# EAGLE board shelves_v05 (EAGLE 9.6.2)
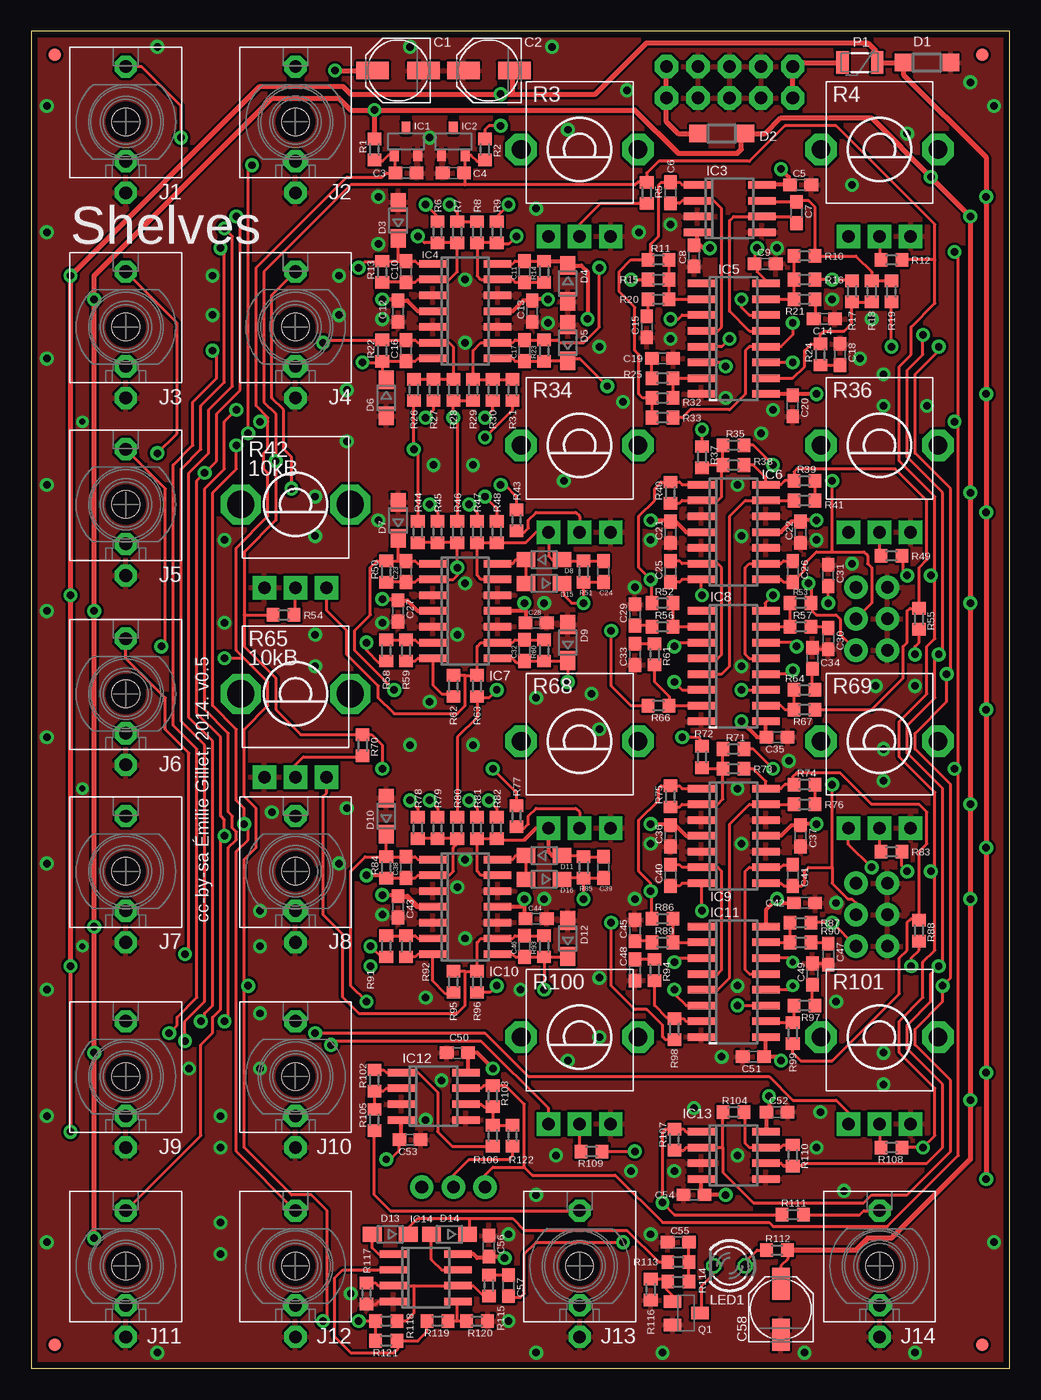
[diagram p5: board, top side]
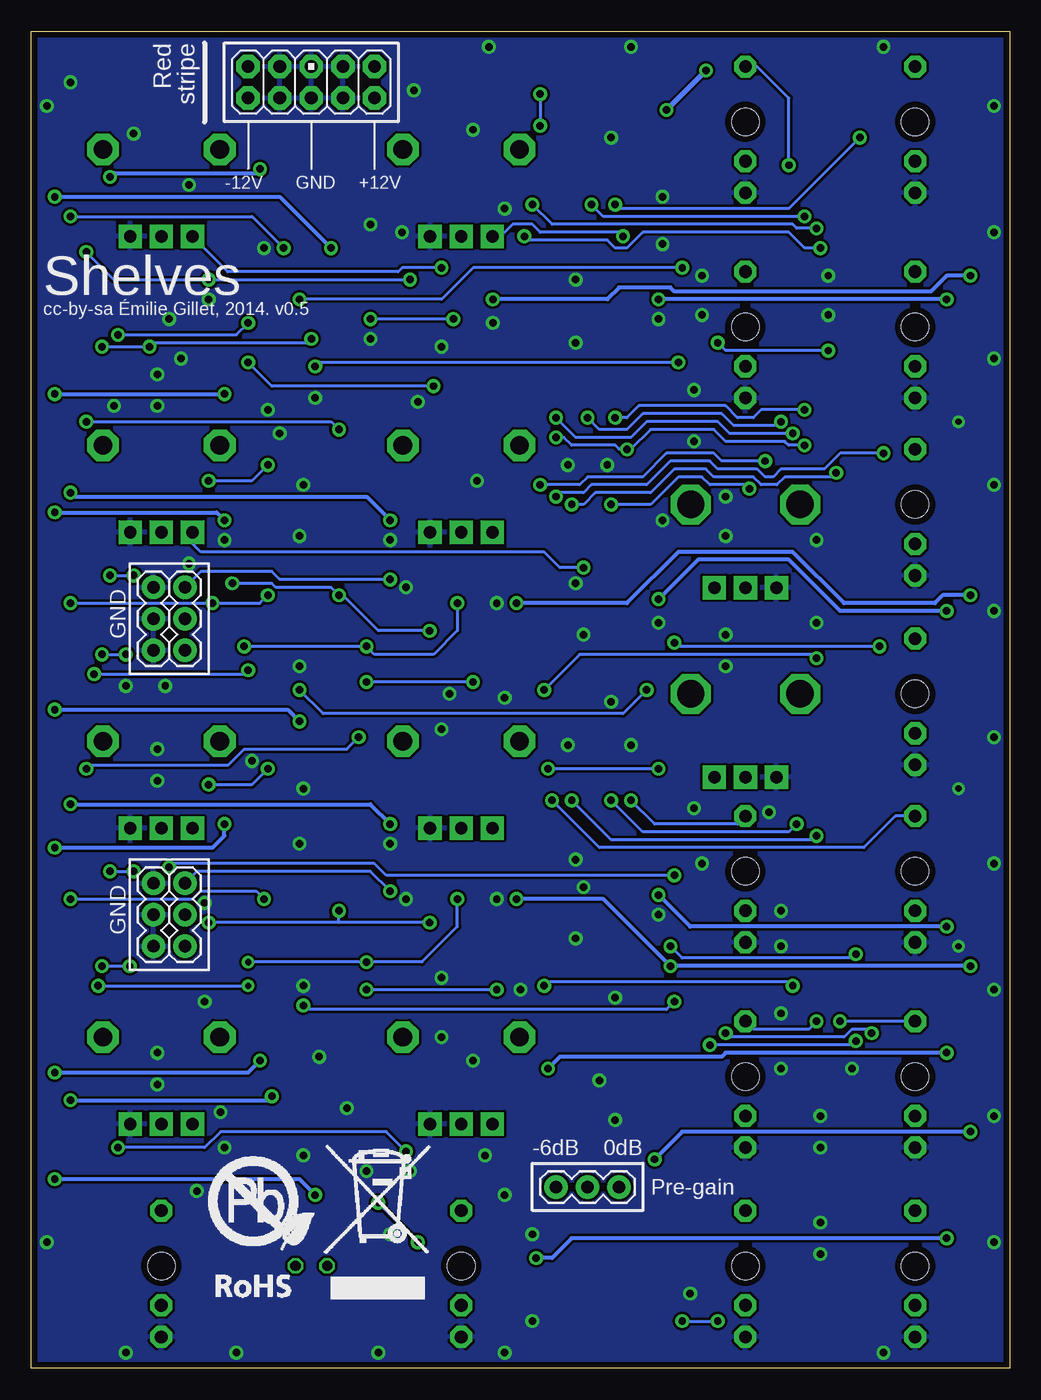
[diagram p6: board, bottom side, seen from below]

Size 78.74 x 107.63 mm. Coordinates in mm from the lower left corner, seen from the top.
Outline: 0,0 78.74,0 78.74,107.63 0,107.63 0,0
Copper layers (1*16): Top 0.035mm / dielectric 1.5mm / Bottom 0.035mm
Design rules "PCBCart-Standard": minimum track width 8mil, minimum drill 0.4mm, track to track 8mil, track to pad 8mil, pad to pad 8mil, via to via 8mil, smd to smd 8mil, copper to edge 20mil, drill to drill 8mil, minimum pad ring 8mil, minimum via ring 10mil, stop-mask expansion 3mil, vias tented up to drill 25mil, thermal gap 8mil

## Footprints (pad centres in the part's own frame; a part is rotated, then mirrored left to right if it is on the bottom)
PANASONIC_C = smd 2.6 x 1.4: + 2.05,0; - -2.05,0
C0603 = smd 1.1 x 1: 1 -0.85,0; 2 0.85,0
SOD123 = smd 1.4 x 1.4: A 1.9,0; C -1.9,0
SOD323-W = smd 1.5 x 1.2: A 1.45,0; C -1.45,0
DBZ_R-PDSO-G3 = smd 0.7 x 1: 1 -0.95,-1.1; 2 0.95,-1.1; 3 0,1.1
SO08 = smd 0.6 x 2.2: 1 -1.905,-2.6; 2 -0.635,-2.6; 3 0.635,-2.6; 4 1.905,-2.6; 5 1.905,2.6; 6 0.635,2.6; 7 -0.635,2.6; 8 -1.905,2.6
SO14 = smd 0.6 x 2.2: 1 -3.81,-2.6; 2 -2.54,-2.6; 3 -1.27,-2.6; 4 0,-2.6; 5 1.27,-2.6; 6 2.54,-2.6; 7 3.81,-2.6; 8 3.81,2.6; 9 2.54,2.6; 10 1.27,2.6; 11 0,2.6; 12 -1.27,2.6; 13 -2.54,2.6; 14 -3.81,2.6
SOIC16N = smd 0.6 x 2.2: 1 -4.445,-2.6; 2 -3.175,-2.6; 3 -1.905,-2.6; 4 -0.635,-2.6; 5 0.635,-2.6; 6 1.905,-2.6; 7 3.175,-2.6; 8 4.445,-2.6; 9 4.445,2.6; 10 3.175,2.6; 11 1.905,2.6; 12 0.635,2.6; 13 -0.635,2.6; 14 -1.905,2.6; 15 -3.175,2.6; 16 -4.445,2.6
WQP_PJ_301M6 = drill 1.016 pad 1.778 octagon: P1 0,-5.715; P2 0,-3.175; P3 0,4.445 | hole 2.2: 0,0
FIDUCIAL-1X2 = smd 1 x 1: 1 0,0
1X03 = drill 1.016 pad 1.88: 1 0,0; 2 2.54,0; 3 5.08,0
AVR_ICSP = drill 1.016 pad 1.88 octagon: 1 -1.27,5.08; 2 1.27,5.08; 3 -1.27,2.54; 4 1.27,2.54; 5 -1.27,0; 6 1.27,0; 7 -1.27,-2.54; 8 1.27,-2.54; 9 -1.27,-5.08; 10 1.27,-5.08
LED3MM = drill 0.813 octagon: A -1.27,0; K 1.27,0
PTC-1206 = smd 1 x 1.8: 1 -1.4,0; 2 1.4,0
SOT23-BEC = smd 1 x 1.4: B -0.95,-1.1; C 0,1.1; E 0.95,-1.1
R0603 = smd 1 x 1.1: 1 -0.85,0; 2 0.85,0
ALPS_POT_VERTICAL_PS = drill 1 pad 1.88 square: P$1 -2.5,7; P$2 0,7; P$3 2.5,7 | drill 1.5 pad 2.54 octagon: P$4 -4.7,0; P$5 4.7,0
ALPS_POT_VERTICAL = drill 1 pad 1.88 square: P$1 -2.5,6.7; P$2 0,6.7; P$3 2.5,6.7 | drill 2.2 pad 3.175 octagon: P$4 -4.4,0; P$5 4.4,0

## Placement (x,y rotation side)
C1  22u  [PANASONIC_C]  29.53,104.46 180 top
C2  22u  [PANASONIC_C]  36.83,104.46 180 top
C3  100n  [C0603]  30.16,96.2 0 top
C4  100n  [C0603]  33.97,96.2 180 top
C5  100n  [C0603]  61.91,95.25 0 top
C6  68p  [C0603]  51.44,94.61 90 top
C7  68p  [C0603]  61.59,93.03 90 top
C8  100n  [C0603]  53.34,89.53 90 top
C9  100n  [C0603]  59.05,88.9 0 top
C10  560p  [C0603]  30.16,88.27 270 top
C11  560p  [C0603]  39.69,88.27 270 top
C12  100n  [C0603]  29.53,85.09 270 top
C13  100n  [C0603]  40.32,85.09 90 top
C14  560p  [C0603]  63.82,84.45 0 top
C15  560p  [C0603]  49.53,83.82 270 top
C16  560p  [C0603]  30.16,81.92 90 top
C17  560p  [C0603]  39.69,81.92 90 top
C18  560p  [C0603]  65.09,81.6 90 top
C19  560p  [C0603]  50.8,81.28 0 top
C20  100n  [C0603]  61.28,77.47 90 top
C21  100n  [C0603]  51.44,67.31 270 top
C22  100n  [C0603]  61.91,67.31 90 top
C23  560p  [C0603]  30.16,64.14 270 top
C24  560p  [C0603]  46.04,64.14 90 top
C25  68p  [C0603]  51.44,64.14 270 top
C26  68p  [C0603]  61.28,64.14 270 top
C27  100n  [C0603]  29.53,60.96 270 top
C28  100n  [C0603]  40.64,60.01 180 top
C29  560p  [C0603]  48.58,60.64 90 top
C30  560p  [C0603]  64.14,58.74 270 top
C31  100n  [C0603]  64.14,63.82 90 top
C32  560p  [C0603]  39.69,57.78 90 top
C33  560p  [C0603]  48.58,57.47 270 top
C34  560p  [C0603]  62.87,57.15 90 top
C35  100n  [C0603]  60.01,50.8 180 top
C36  100n  [C0603]  51.44,42.86 270 top
C37  100n  [C0603]  61.91,42.86 90 top
C38  560p  [C0603]  30.16,40.32 270 top
C39  560p  [C0603]  46.04,40.32 90 top
C40  68p  [C0603]  51.44,39.69 270 top
C41  68p  [C0603]  61.28,39.69 270 top
C42  100n  [C0603]  62.23,37.47 0 top
C43  100n  [C0603]  29.53,37.15 270 top
C44  100n  [C0603]  40.64,36.2 180 top
C45  560p  [C0603]  48.58,35.24 90 top
C46  560p  [C0603]  39.69,33.97 90 top
C47  560p  [C0603]  64.14,33.34 270 top
C48  560p  [C0603]  48.58,32.07 270 top
C49  560p  [C0603]  62.87,31.75 90 top
C50  100n  [C0603]  34.29,25.4 180 top
C51  100n  [C0603]  58.1,25.08 0 top
C52  100n  [C0603]  60.01,20.64 0 top
C53  100n  [C0603]  30.48,18.41 180 top
C54  100n  [C0603]  53.34,13.97 0 top
C55  100n  [C0603]  52.07,10.16 180 top
C56  100n  [C0603]  36.83,9.84 90 top
C57  100n  [C0603]  38.42,6.67 270 top
C58  22u  [PANASONIC_C]  60.33,4.76 90 top
D1  1N5819HW  [SOD123]  72.07,105.09 180 top
D2  1N5819HW  [SOD123]  55.56,99.38 180 top
D3  1N4148  [SOD323-W]  29.53,92.39 90 top
D4  1N4148  [SOD323-W]  43.18,87.31 270 top
D5  1N4148  [SOD323-W]  43.18,82.55 90 top
D6  1N4148  [SOD323-W]  28.57,78.11 270 top
D7  1N4148  [SOD323-W]  29.53,68.26 90 top
D8  1N4148  [SOD323-W]  41.27,65.09 0 top
D9  1N4148  [SOD323-W]  43.18,58.42 90 top
D10  1N4148  [SOD323-W]  28.57,44.45 90 top
D11  1N4148  [SOD323-W]  41.27,41.27 0 top
D12  1N4148  [SOD323-W]  43.18,34.61 90 top
D13  1N4148  [SOD323-W]  28.89,10.79 180 top
D14  1N4148  [SOD323-W]  33.66,10.79 180 top
D15  1N4148  [SOD323-W]  41.27,63.18 180 top
D16  1N4148  [SOD323-W]  41.27,39.37 180 top
IC1  LM4040B10  [DBZ_R-PDSO-G3]  30.16,98.74 0 top
IC2  LM4040B10  [DBZ_R-PDSO-G3]  33.97,98.74 0 top
IC3  TL072D  [SO08]  56.2,93.34 270 top
IC4  TL074D  [SO14]  34.92,85.09 270 top
IC5  V2164SZ  [SOIC16N]  56.52,82.87 270 top
IC6  TL074D  [SO14]  56.52,67.31 270 top
IC7  TL074D  [SO14]  34.92,60.96 270 top
IC8  V2164SZ  [SOIC16N]  56.52,56.52 270 top
IC9  TL074D  [SO14]  56.52,42.86 270 top
IC10  TL074D  [SO14]  34.92,37.15 270 top
IC11  V2164SZ  [SOIC16N]  56.52,31.11 270 top
IC12  TL072D  [SO08]  32.38,21.91 270 top
IC13  TL072D  [SO08]  56.52,17.14 270 top
IC14  TL072D  [SO08]  31.75,7.3 270 top
J1  PJ301_THONKICONN6  [WQP_PJ_301M6]  7.62,100.33 0 top
J2  PJ301_THONKICONN6  [WQP_PJ_301M6]  21.27,100.33 0 top
J3  PJ301_THONKICONN6  [WQP_PJ_301M6]  7.62,83.82 0 top
J4  PJ301_THONKICONN6  [WQP_PJ_301M6]  21.27,83.82 0 top
J5  PJ301_THONKICONN6  [WQP_PJ_301M6]  7.62,69.53 0 top
J6  PJ301_THONKICONN6  [WQP_PJ_301M6]  7.62,54.29 0 top
J7  PJ301_THONKICONN6  [WQP_PJ_301M6]  7.62,40.01 0 top
J8  PJ301_THONKICONN6  [WQP_PJ_301M6]  21.27,40.01 0 top
J9  PJ301_THONKICONN6  [WQP_PJ_301M6]  7.62,23.5 0 top
J10  PJ301_THONKICONN6  [WQP_PJ_301M6]  21.27,23.5 0 top
J11  PJ301_THONKICONN6  [WQP_PJ_301M6]  7.62,8.26 0 top
J12  PJ301_THONKICONN6  [WQP_PJ_301M6]  21.27,8.26 0 top
J13  PJ301_THONKICONN6  [WQP_PJ_301M6]  44.13,8.26 0 top
J14  PJ301_THONKICONN6  [WQP_PJ_301M6]  68.26,8.26 0 top
JP1  FIDUCIAL1X2  [FIDUCIAL-1X2]  1.91,105.73 0 top
JP2  FIDUCIAL1X2  [FIDUCIAL-1X2]  76.52,105.73 0 top
JP3  FIDUCIAL1X2  [FIDUCIAL-1X2]  1.91,1.91 0 top
JP4  FIDUCIAL1X2  [FIDUCIAL-1X2]  76.52,1.91 0 top
JP5  [1X03]  66.36,57.78 90 bottom
JP6  [1X03]  68.9,57.78 90 bottom
JP7  [1X03]  68.9,33.97 90 bottom
JP11  M05X2PTH  [AVR_ICSP]  56.2,103.5 270 bottom
JP12  [1X03]  31.43,14.61 180 bottom
JP13  [1X03]  66.36,33.97 90 bottom
LED1  WP-710A10GD  [LED3MM]  56.2,8.26 180 top
P1  PTCSMD  [PTC-1206]  66.67,105.09 180 top
Q1  MMBT3904  [SOT23-BEC]  52.7,4.45 270 top
R1  3.3k  [R0603]  27.62,98.11 270 top
R2  1.0k  [R0603]  36.51,98.11 270 top
R3  10kB  [ALPS_POT_VERTICAL_PS]  44.13,98.11 180 top
R4  10kB  [ALPS_POT_VERTICAL_PS]  68.26,98.11 180 top
R5  100k  [R0603]  49.53,94.61 270 top
R6  100k  [R0603]  32.7,91.44 270 top
R7  100k  [R0603]  34.29,91.44 270 top
R8  100k  [R0603]  35.88,91.44 270 top
R9  100k  [R0603]  37.47,91.44 270 top
R10  100k  [R0603]  62.23,89.53 0 top
R11  100k  [R0603]  50.48,89.22 180 top
R12  100k  [R0603]  69.22,89.22 180 top
R13  18k  [R0603]  28.26,88.27 90 top
R14  18k  [R0603]  41.27,88.27 90 top
R15  100k  [R0603]  50.48,87.63 0 top
R16  100k  [R0603]  62.23,87.63 180 top
R17  100k  [R0603]  66.04,86.68 270 top
R18  100k  [R0603]  67.63,86.68 270 top
R19  100k  [R0603]  69.22,86.68 270 top
R20  510  [R0603]  50.48,86.04 0 top
R21  510  [R0603]  62.23,86.04 180 top
R22  12k  [R0603]  28.26,81.92 270 top
R23  12k  [R0603]  41.27,81.92 270 top
R24  510  [R0603]  63.5,81.6 90 top
R25  510  [R0603]  50.8,79.69 0 top
R26  120k  [R0603]  30.8,78.74 90 top
R27  120k  [R0603]  32.38,78.74 90 top
R28  200k  [R0603]  33.97,78.74 90 top
R29  200k  [R0603]  35.56,78.74 90 top
R30  120k  [R0603]  37.15,78.74 90 top
R31  120k  [R0603]  38.73,78.74 90 top
R32  100k  [R0603]  50.8,78.11 0 top
R33  100k  [R0603]  50.8,76.52 0 top
R34  10kB  [ALPS_POT_VERTICAL_PS]  44.13,74.3 180 top
R35  100k  [R0603]  56.52,74.3 0 top
R36  10kB  [ALPS_POT_VERTICAL_PS]  68.26,74.3 180 top
R37  100k  [R0603]  53.98,73.34 270 top
R38  100k  [R0603]  56.52,72.71 0 top
R39  100k  [R0603]  62.23,71.44 0 top
R40  100k  [R0603]  51.44,70.48 90 top
R41  100k  [R0603]  62.23,69.85 180 top
R42  10kB  [ALPS_POT_VERTICAL]  21.27,69.53 180 top
R43  100k  [R0603]  39.05,68.26 270 top
R44  120k  [R0603]  31.11,67.31 270 top
R45  120k  [R0603]  32.7,67.31 270 top
R46  200k  [R0603]  34.29,67.31 270 top
R47  100k  [R0603]  35.88,67.31 270 top
R48  100k  [R0603]  37.47,67.31 270 top
R49  100k  [R0603]  69.22,65.41 180 top
R50  12k  [R0603]  28.57,64.14 90 top
R51  18k  [R0603]  44.45,64.14 270 top
R52  100k  [R0603]  50.8,61.59 0 top
R53  100k  [R0603]  61.91,61.59 180 top
R54  200k  [R0603]  20.32,60.64 0 top
R55  100k  [R0603]  71.44,60.33 270 top
R56  510  [R0603]  50.8,59.69 0 top
R57  510  [R0603]  61.91,59.69 180 top
R58  100k  [R0603]  28.57,57.78 90 top
R59  100k  [R0603]  30.16,57.78 270 top
R60  22k  [R0603]  41.27,57.78 270 top
R61  510  [R0603]  50.16,57.47 270 top
R62  150k  [R0603]  33.97,54.93 90 top
R63  1.5M  [R0603]  35.88,54.93 90 top
R64  510  [R0603]  62.23,54.61 180 top
R65  10kB  [ALPS_POT_VERTICAL]  21.27,54.29 180 top
R66  100k  [R0603]  50.48,53.34 0 top
R67  100k  [R0603]  62.23,53.02 180 top
R68  10kB  [ALPS_POT_VERTICAL_PS]  44.13,50.48 180 top
R69  10kB  [ALPS_POT_VERTICAL_PS]  68.26,50.48 180 top
R70  200k  [R0603]  26.67,50.16 270 top
R71  100k  [R0603]  56.52,49.85 0 top
R72  100k  [R0603]  53.98,49.21 270 top
R73  100k  [R0603]  56.52,48.26 0 top
R74  100k  [R0603]  62.23,46.99 0 top
R75  100k  [R0603]  51.44,46.04 90 top
R76  100k  [R0603]  62.23,45.4 180 top
R77  100k  [R0603]  39.05,44.45 270 top
R78  120k  [R0603]  31.11,43.5 270 top
R79  120k  [R0603]  32.7,43.5 270 top
R80  200k  [R0603]  34.29,43.5 270 top
R81  100k  [R0603]  35.88,43.5 270 top
R82  100k  [R0603]  37.47,43.5 270 top
R83  100k  [R0603]  69.22,41.59 180 top
R84  12k  [R0603]  28.57,40.32 90 top
R85  18k  [R0603]  44.45,40.32 270 top
R86  100k  [R0603]  50.8,36.2 0 top
R87  100k  [R0603]  61.91,35.88 180 top
R88  100k  [R0603]  71.44,35.24 270 top
R89  510  [R0603]  50.8,34.29 0 top
R90  510  [R0603]  61.91,34.29 180 top
R91  100k  [R0603]  28.57,33.97 90 top
R92  100k  [R0603]  30.16,33.97 270 top
R93  22k  [R0603]  41.27,33.97 270 top
R94  510  [R0603]  50.16,32.07 270 top
R95  150k  [R0603]  33.97,31.11 90 top
R96  1.5M  [R0603]  35.88,31.11 90 top
R97  510  [R0603]  62.23,29.21 180 top
R98  100k  [R0603]  51.75,27.3 90 top
R99  100k  [R0603]  61.28,26.99 90 top
R100  10kB  [ALPS_POT_VERTICAL_PS]  44.13,26.67 180 top
R101  10kB  [ALPS_POT_VERTICAL_PS]  68.26,26.67 180 top
R102  100k  [R0603]  27.62,23.18 90 top
R103  100k  [R0603]  37.15,21.91 90 top
R104  100k  [R0603]  56.52,20.64 180 top
R105  100k  [R0603]  27.62,20 90 top
R106  200k  [R0603]  37.15,18.73 90 top
R107  200k  [R0603]  51.75,18.41 90 top
R108  100k  [R0603]  69.22,17.78 180 top
R109  100k  [R0603]  45.09,17.46 180 top
R110  100k  [R0603]  61.28,17.14 90 top
R111  1.0k  [R0603]  61.28,12.38 0 top
R112  1.0k  [R0603]  60.01,9.53 0 top
R113  12k  [R0603]  52.07,8.57 0 top
R114  100k  [R0603]  52.07,6.99 180 top
R115  100k  [R0603]  36.83,6.67 270 top
R116  22k  [R0603]  49.85,6.35 90 top
R117  100k  [R0603]  26.99,6.03 90 top
R118  100k  [R0603]  28.57,3.81 180 top
R119  220k  [R0603]  32.7,3.81 180 top
R120  100k  [R0603]  35.88,3.81 180 top
R121  100k  [R0603]  28.57,2.22 180 top
R122  100k  [R0603]  38.73,18.73 270 top
U$2  [ROHS_BIG]  65.72,4.76 0 bottom

## Tracks (layer width: path | path; a pad name or v marks a point on that pad's centre or on a via)
AREF_+10  (via drill 0.6)
  Top 0.254: C3.1 29.31,97.54 IC1.1 28.75,97.64 28.26,97.16 27.73,97.16 R1.2 | C3.1 29.21,96.1 | 19.05,76.2 19.05,76.52 18.1,77.47 18.1,88.58 25.4,95.89 28.26,95.89 28.57,96.2 C3.1 | 17.14,57.15 19.05,55.24 19.05,53.34 17.14,51.44 17.14,46.04 18.1,45.09 18.1,41.91 17.14,40.96 17.14,30.8 | 17.14,57.15 16.51,57.78 16.51,66.04 19.05,68.58 19.05,72.07 18.73,72.39 18.73,73.66 19.05,73.98 19.05,76.2 | R29.1 R28.1 v33.97,76.52 34.29,76.2 R46.1 | 19.05,76.2 v18.41,76.2 | 17.14,57.15 v15.56,57.15 | R121.2 R118.2 v26.35,3.81 | v23.5,3.81 23.81,4.13 23.81,12.7 22.54,13.97 20.95,13.97 17.14,17.78 17.14,30.8 | 17.14,30.8 v17.46,30.8 | R80.1 34.29,50.8 35.88,52.39 R63.1 35.98,53.98 36.83,53.98 v37.47,54.61 | v37.47,30.8 36.93,30.27 R96.1
  Bottom 0.254: v33.97,76.52 33.02,75.56 30.8,75.56 29.53,76.83 23.18,76.83 22.23,75.88 18.73,75.88 v18.41,76.2 | v15.56,57.15 15.88,57.47 34.61,57.47 v37.47,54.61 | v26.35,3.81 v23.5,3.81 | v17.46,30.8 17.78,31.11 37.15,31.11 v37.47,30.8
AREF_-10  (via drill 0.6)
  Top 0.254: R108.1 v71.75,17.78 72.71,18.73 72.71,22.54 69.85,25.4 69.85,27.94 71.75,29.84 71.75,32.7 72.71,33.66 72.71,40.01 | 72.71,40.01 72.71,46.35 69.85,49.21 69.85,52.07 72.07,54.29 72.07,58.1 72.71,58.74 72.71,63.82 | 72.71,63.82 72.71,70.17 69.85,73.03 69.85,80.64 70.8,81.6 70.8,83.82 72.71,85.72 72.71,89.22 | 72.71,89.22 72.71,92.08 64.77,100.01 60.64,100.01 57.78,97.16 50.48,97.16 49.53,96.2 R5.1 48.79,95.47 48.58,95.25 34.92,95.25 | 72.71,89.22 R12.1 | R49.1 70.17,65.3 70.17,64.14 v70.48,63.82 | 72.71,63.82 v72.39,63.82 | 70.17,41.49 R83.1 70.06,40.42 v70.48,40.01 | 72.71,40.01 v72.39,40.01 | 17.14,60.64 17.14,58.1 19.68,55.56 19.68,53.02 21.69,51.02 R70.1 | 17.14,60.64 17.14,65.72 19.68,68.26 v19.68,73.03 19.68,76.83 18.73,77.79 18.73,88.27 25.72,95.25 34.92,95.25 | 17.14,60.64 R54.1 | R70.1 26.57,51.12 | v28.26,48.26 28.26,50.16 27.41,51.02 R70.1 | R109.1 v48.58,17.46 | R2.2 36.41,97.16 35.88,97.16 35.39,97.64 IC2.2 34.92,96.3 C4.1 34.92,96.1 34.92,95.25 | R77.1 39.05,46.35 v37.15,48.26 | v37.78,71.12 38.1,71.12 39.05,70.17 R43.1
  Bottom 0.254: v72.39,63.82 v70.48,63.82 | v72.39,40.01 v70.48,40.01 | v37.78,71.12 34.61,71.12 33.97,71.75 29.53,71.75 27.62,73.66 23.81,73.66 23.18,73.03 v19.68,73.03 | v28.26,48.26 v37.15,48.26 | v48.58,17.46 50.16,19.05 63.5,19.05 64.77,17.78 v71.75,17.78
BP_1  (via drill 0.6)
  Top 0.254: v53.98,36.83 53.98,38.99 IC9.7 52.39,39.05 52.17,38.84 C40.2 | R87.1 v64.45,35.88 JP13.1 | R98.1 51.02,26.45 50.8,26.67 50.8,27.62 49.53,28.89 48.58,28.89 46.67,30.8 v46.67,35.88
  Bottom 0.254: 53.98,35.88 v64.45,35.88 | v46.67,35.88 53.98,35.88 | 53.98,35.88 v53.98,36.83
BP_2  (via drill 0.6)
  Top 0.254: C25.2 52.17,63.28 52.39,63.5 IC6.7 53.91,62.29 v53.98,62.23 | R66.1 48.26,53.34 46.67,54.93 v46.67,59.37 | v62.55,63.18 62.76,62.97 R53.1 62.87,61.49 62.87,60.96 63.18,60.64 64.77,60.64 65.09,60.33 65.09,59.05 JP5.1
  Bottom 0.254: v46.67,59.37 50.8,59.37 53.66,62.23 v53.98,62.23 54.61,62.87 59.05,62.87 59.37,63.18 v62.55,63.18
F_GLOBAL  (via drill 0.6)
  Top 0.254: R8.1 R7.1 34.29,93.03 v33.66,93.66 | v16.51,92.71 16.83,92.39 16.83,78.74 14.92,76.83 14.92,73.03 v13.97,72.07 13.34,71.44 13.34,52.7 15.24,50.8 15.24,44.45 15.56,44.13 v15.56,42.86 15.24,42.55 15.24,28.89 14.61,28.26 14.61,26.99 13.65,26.04 13.65,18.73 J11.P3 | v35.24,69.53 35.88,68.9 R47.1 | v35.24,45.72 35.88,45.09 R81.1
  Bottom 0.254: v33.66,93.66 32.7,92.71 v16.51,92.71 | v13.97,72.07 14.29,71.75 18.1,71.75 18.73,71.12 20,71.12 20.64,71.75 23.81,71.75 24.45,72.39 26.99,72.39 28.89,70.48 33.34,70.48 34.29,69.53 v35.24,69.53 | v35.24,45.72 32.07,42.55 15.88,42.55 v15.56,42.86
GAIN_GLOBAL  (via drill 0.6)
  Top 0.254: J12.P3 16.51,17.46 16.51,41.59 17.46,42.55 17.46,43.5 v17.14,43.81 17.14,45.09 16.51,45.72 16.51,51.44 14.61,53.34 14.61,70.48 16.51,72.39 v16.51,74.3 | R31.1 38.73,77.15 v36.51,74.93 | R26.1 v30.8,73.98 31.11,73.66 R44.1 | v32.07,45.72 32.7,45.09 R79.1
  Bottom 0.254: v16.51,74.3 17.78,74.3 18.1,74.61 22.86,74.61 23.81,75.56 28.89,75.56 30.48,73.98 v30.8,73.98 31.43,73.98 31.75,74.3 35.24,74.3 35.88,74.93 v36.51,74.93 | v32.07,45.72 29.53,43.18 17.78,43.18 v17.14,43.81
GND  (via drill 0.5, 0.6)
  Top 0.254: C47.2 64.02,32.6 C49.2 | IC14.4 27.94,5.4 27.73,5.18 R117.1 | C34.2 62.98,57.89 C30.2
  other vias: 60.01,90.17 64.45,86.04 51.44,92.08 51.44,82.87 49.85,66.67 56.83,71.12 63.18,66.67 59.69,77.15 55.88,78.11 49.85,42.23 60.96,48.9 56.83,46.67 48.58,62.87 48.58,37.78 64.77,29.53 51.75,15.88 63.5,20.64 56.83,17.14 66.67,81.28 32.07,99.06 28.26,84.45 41.59,84.14 34.92,82.55 27.94,94.3 45.72,82.23 67.63,84.45 47.62,77.79 25.4,74.61 25.4,78.74 22.86,70.17 28.26,60.01 55.56,25.08 71.12,54.93 68.58,49.85 45.09,54.29 34.92,63.18 34.29,59.05 34.92,87.63 28.26,36.51 31.75,20 33.02,23.18 48.9,91.44 40.64,93.34 14.61,87.95 14.61,84.77 24.77,84.77 27.94,68.26 15.56,66.67 15.56,60.01 22.86,59.05 22.86,56.52 25.4,45.09 19.37,44.77 18.41,36.83 30.48,50.16 18.41,28.57 43.18,24.77 12.7,24.13 39.37,30.48 45.72,26.67 45.72,31.43 56.83,30.8 57.15,42.23 45.72,51.44 57.15,66.99 57.15,56.52 32.38,72.71 35.56,72.71 42.86,71.44 43.18,99.69 47.94,102.87 72.07,77.47 70.48,99.38 63.18,17.78 42.23,17.14 40.64,13.97 15.24,17.78 15.24,20.32 18.41,24.13 25.72,6.03 38.42,10.79 38.42,3.81 15.24,9.21 35.56,50.16 40.64,53.98 27.94,90.49 31.75,29.84 34.92,40.96 48.26,15.88 18.41,33.97 34.29,38.73 34.92,34.61 68.58,77.47 68.58,80.01 58.74,75.25 68.58,22.86 68.58,25.4 65.41,14.29 75.56,103.5 32.07,53.66 4.13,76.2 4.13,46.67 4.13,33.97 68.58,47.31 24.77,87.95 22.86,66.99 24.77,40.64 15.24,11.75 53.34,20.95 1.27,91.44 1.27,101.6 1.27,81.28 1.27,71.12 1.27,60.96 1.27,50.8 1.27,40.64 10.16,1.27 40.64,1.27 50.8,1.27 62.23,1.27 71.12,1.27 77.47,10.16 10.16,106.36 49.85,10.79 66.04,95.25 1.27,30.48 1.27,20.32 1.27,10.16 77.47,101.6 30.48,106.36 41.91,106.36 64.77,37.47 66.04,64.77 67.94,54.93 41.27,37.78 41.27,61.59
  pour Bottom: 0,107.63 0,0 78.74,0 78.74,107.63
  pour Top (isolate 0.203): 0,107.63 0,0 78.74,0 78.74,107.63
HP_1  (via drill 0.6)
  Top 0.254: IC9.1 52.39,46.67 52.17,46.89 R75.2 50.7,46.89 50.48,46.67 50.48,45.72 48.9,44.13 48.9,40.01 49.85,39.05 v49.85,38.42 49.95,38.31 R86.1
  Bottom 0.254: JP13.3 65.41,40.01 51.44,40.01 v49.85,38.42
HP_2  (via drill 0.6)
  Top 0.254: IC6.1 52.39,71.12 52.17,71.33 R40.2 | R40.2 51.02,71.33 | R40.2 50.7,71.33 50.16,70.8 50.16,69.85 48.9,68.58 48.9,64.45 v49.85,63.5 49.95,63.4 R52.1
  Bottom 0.254: JP5.3 65.09,64.14 59.37,64.14 58.74,63.5 v49.85,63.5
IN  (via drill 0.6)
  Top 0.254: v48.26,87.63 R15.1 | R16.1 v64.45,87.63 65.94,87.63 R17.1 | IC12.7 36.2,22.54 36.41,22.76 R103.2 | R103.2 37.25,22.86 | 74.61,48.26 74.61,17.14 68.9,11.43 59.69,11.43 59.37,11.75 50.8,11.75 46.99,15.56 40.32,15.56 39.69,16.19 | 74.61,48.26 v74.3,48.26 | 74.61,48.26 74.61,76.2 | 74.61,76.2 v74.3,76.2 | 74.61,76.2 74.61,89.53 v74.3,89.85 | 53.87,74.3 R37.1 v53.98,75.56 | 53.76,49.85 R72.1 53.98,50.48 53.66,50.8 v52.39,50.8 | R103.2 38.2,22.76 39.69,21.27 39.69,16.19 | 39.69,16.19 37.15,16.19 36.51,15.56 JP12.3
  Bottom 0.254: v48.26,87.63 v64.45,87.63 72.07,87.63 v74.3,89.85 | v53.98,75.56 54.61,76.2 v74.3,76.2 | v52.39,50.8 53.34,49.85 61.59,49.85 62.87,48.58 73.98,48.58 v74.3,48.26
IN_INV
  Top 0.254: R102.2 28.36,24.03 28.57,23.81 IC12.1 31.11,23.81 32.7,22.23 32.7,19.05 33.87,17.88 R106.1
IN_INV1
  Top 0.254: R104.1 57.47,20.54 57.47,18.1 57.78,17.78 IC13.7 60.33,17.78 60.54,18 R110.2
J_HF_CV  (via drill 0.6)
  Top 0.254: v17.78,96.84 17.46,96.52 v17.46,75.25 | R30.1 37.15,77.15 v36.51,76.52
  Bottom 0.254: J2.P3 20.32,104.78 17.78,102.23 v17.78,96.84 | v36.51,76.52 34.92,74.93 30.48,74.93 29.21,76.2 23.5,76.2 22.54,75.25 v17.46,75.25
J_HF_F  (via drill 0.6)
  Top 0.254: v31.75,93.66 32.7,92.71 R6.1 | v12.06,99.06 12.06,101.6 8.89,104.78 J1.P3
  Bottom 0.254: v31.75,93.66 31.43,93.34 17.78,93.34 v12.06,99.06
J_IN
  Top 0.254: R105.1 27.62,13.97 28.89,12.7 J13.P3
J_LF_CV  (via drill 0.6)
  Top 0.254: v15.56,27.94 15.88,28.26 15.88,41.91 16.51,42.55 16.51,43.18 16.19,43.5 16.19,44.45 15.88,44.77 15.88,51.12 13.97,53.02 13.97,70.8 15.56,72.39 15.56,76.2 v16.51,77.15 | v31.75,76.52 32.38,77.15 R27.1
  Bottom 0.254: v15.56,27.94 16.19,27.3 20.64,27.3 J10.P3 | v16.51,77.15 20,77.15 20.64,76.52 21.91,76.52 22.86,77.47 29.84,77.47 30.8,76.52 v31.75,76.52
J_LF_F  (via drill 0.6)
  Top 0.254: v15.56,91.76 16.19,91.12 16.19,79.06 14.29,77.15 14.29,73.66 12.7,72.07 12.7,52.39 14.61,50.48 14.61,29.21 13.97,28.57 13.97,28.26 v13.65,27.94 | v38.42,93.66 37.47,92.71 R9.1
  Bottom 0.254: v38.42,93.66 36.83,92.08 17.46,92.08 17.14,91.76 v15.56,91.76 | J9.P3 v13.65,27.94
LP
  Top 0.254: IC3.1 53.49,95.15 53.34,95.3 53.29,95.25 52.39,95.25 52.17,95.47 C6.2 50.7,95.47 50.48,95.25 50.48,91.12 49.85,90.49 49.85,89.43 R11.2 48.26,89.22 47.31,88.27 47.31,86.68 48.58,85.41 48.58,81.92 48.9,81.6 48.9,78.42 49.21,78.11 R32.1 R33.1
LP1
  Top 0.254: IC3.7 58.9,93.88 C7.2 61.7,93.98 62.55,93.98 63.08,93.45 R10.2 66.36,89.53 67.63,88.27 R18.1 R19.1
MID1_F1  (via drill 0.6)
  Top 0.254: IC8.14 61.28,58.42 v61.59,58.1 | v51.75,58.1 52.07,58.42 IC8.3 | D15.C 42.86,63.05 42.86,62.23 43.5,61.59 v44.45,61.59 R51.2 C24.1
  Bottom 0.254: v61.59,58.1 v51.75,58.1 51.12,57.47 46.35,57.47 44.45,59.37 v44.45,61.59
MID1_F2  (via drill 0.5, 0.6)
  Top 0.254: IC11.3 52.07,33.02 v51.75,32.7 | IC11.14 60.96,33.02 v61.28,32.7 | R85.2 C39.1 | D16.C 42.83,39.47 R85.2 | v44.45,37.78 R85.2
  Bottom 0.254: v44.45,37.78 44.45,35.56 47.31,32.7 v51.75,32.7 v61.28,32.7
MINUS_BUS  (via drill 0.5, 0.6)
  Top 0.254: v73.03,82.23 73.03,81.92 71.12,80.01 71.12,73.66 73.98,70.8 73.98,56.2 v73.66,55.88 73.66,53.66 71.12,51.12 71.12,49.85 73.98,46.99 73.98,31.43 v73.34,30.8 73.34,29.53 71.12,27.3 71.12,26.04 73.98,23.18 73.98,17.46 70.48,13.97 67.63,13.97 66.99,13.34 58.1,13.34 55.66,15.77 55.66,17.78 | R19.2 69.32,85.72 69.22,85.62 v69.22,82.23 | IC8.12 60.96,55.88 v61.28,56.2 | v61.28,30.8 60.96,30.48 IC11.12 | R107.1 52.49,17.57 52.7,17.78 IC13.2 55.66,17.78 | 55.66,17.78 R104.2 | v56.2,82.87 55.56,82.23 IC5.5
  Bottom 0.254: v73.03,82.23 v69.22,82.23 68.9,82.55 56.52,82.55 v56.2,82.87 | v73.66,55.88 61.59,55.88 v61.28,56.2 | v73.34,30.8 v61.28,30.8
N$1
  Top 0.254: IC5.2 R20.2 R15.2 R11.1
N$2
  Top 0.254: R25.1 C19.1
N$3  (via drill 0.6)
  Top 0.254: IC4.14 38.73,88.9 38.95,89.11 C11.1 R14.2 41.49,88.9 | IC5.3 52.39,84.77 52.07,84.45 v51.44,84.45
  Top 0.305: R14.2 42.83,89.11 D4.C 44.27,88.76 44.77,88.27 v44.77,84.45
  Bottom 0.254: v44.77,84.45 v51.44,84.45
N$4
  Top 0.254: IC5.4 55.24,83.5 55.56,83.82 55.56,93.34 54.93,93.98 IC3.2 52.39,93.98 52.17,93.77 C6.1
N$5
  Top 0.254: C14.1 63.08,84.57 R21.1
N$6
  Top 0.254: R122.2 38.73,17.14 38.42,16.83 35.24,16.83 33.97,15.56 JP12.2
N$7  (via drill 0.6)
  Top 0.254: IC5.6 55.56,80.96 v55.88,80.64 | IC4.7 31.11,81.28 30.9,81.06 C16.1 R22.2 | R22.2 28.16,80.96 v26.67,80.96 | D6.C 28.26,79.87 R22.2
  Bottom 0.254: v26.67,80.96 55.56,80.96 v55.88,80.64
N$8
  Top 0.254: IC10.14 38.73,40.96 39.05,41.27 D11.C D16.A
N$9
  Top 0.254: IC12.2 28.57,22.54 28.36,22.33 R102.1 R105.2
N$10
  Top 0.254: C15.1 49.63,84.77 R20.1
N$11
  Top 0.254: R95.1 33.87,30.16 33.34,30.16 32.33,31.18 IC10.7 31.11,33.34 30.9,33.12 R92.2
N$12
  Top 0.254: R109.2 44.13,17.57 R100.P$2
N$13  (via drill 0.6)
  Top 0.254: R22.1 C16.2 30.9,82.77 31.11,82.55 IC4.6 33.66,82.55 33.97,82.23 R28.2 R27.2 R26.2 | R22.1 28.16,82.87 | v14.61,81.92 14.92,81.6 14.92,79.69 13.02,77.79 13.02,74.3 11.43,72.71 11.43,51.75 13.34,49.85 13.34,29.84 11.75,28.26 11.75,27.62 v11.11,26.99 | v23.5,82.55 23.71,82.77 R22.1 | R101.P$3 65.76,20.6 64.77,21.59 61.28,21.59 59.37,23.5 40.01,23.5 36.51,26.99 v22.86,26.99
  Bottom 0.254: v23.5,82.55 22.86,81.92 v14.61,81.92 | v11.11,26.99 11.43,27.3 12.7,27.3 13.34,26.67 22.54,26.67 v22.86,26.99
N$14
  Top 0.254: IC7.14 38.73,64.77 39.05,65.09 D8.C D15.A
N$15
  Top 0.254: R108.2 68.26,17.88 R101.P$2
N$16
  Top 0.254: 59.05,86.04 IC5.15 R21.2 R16.2 R10.1
N$17
  Top 0.254: R32.2 R25.2 IC5.7
N$18  (via drill 0.6)
  Top 0.254: R14.1 C11.2 38.95,87.42 38.73,87.63 IC4.13 36.2,87.63 35.88,87.95 R8.2 R9.2 37.57,90.49 38.42,90.49 v39.05,91.12 | v15.24,90.17 15.56,89.85 15.56,79.38 13.65,77.47 13.65,73.98 12.06,72.39 12.06,52.07 13.97,50.16 13.97,29.53 12.38,27.94 v12.38,26.35 | R100.P$3 41.59,19.71 41.59,20.95 36.2,26.35 24.45,26.35 v24.13,26.04
  Bottom 0.254: v15.24,90.17 16.51,90.17 17.78,91.44 29.53,91.44 30.8,90.17 31.75,90.17 32.38,90.81 38.73,90.81 v39.05,91.12 | v12.38,26.35 12.7,26.04 v24.13,26.04
N$19
  Top 0.254: C7.1 61.06,92.71 IC3.6 56.52,92.71 56.2,92.39 56.2,85.09 57.78,83.5 IC5.13
N$21
  Top 0.254: R3.P$2 44.13,92.08 45.82,93.77 R5.2
N$22  (via drill 0.6)
  Top 0.254: v61.28,80.96 IC5.11 | IC4.8 38.73,81.28 38.95,81.06 C17.1 R23.2 41.31,81.1 D5.C 43.36,81.28 44.13,81.28 v46.35,79.06
  Bottom 0.254: v61.28,80.96 59.37,79.06 v46.35,79.06
N$23  (via drill 0.6)
  Top 0.254: v45.72,88.58 45.72,83.82 44.45,82.55 42.55,82.55 42.33,82.77 R23.1 C17.2 38.95,82.77 38.73,82.55 IC4.9 36.2,82.55 35.56,81.92 R29.2 R30.2 R31.2
  Bottom 0.254: R4.P$3 62.92,88.27 49.21,88.27 48.9,88.58 v45.72,88.58
N$25
  Top 0.254: R89.1 49.85,34.39 C45.1
N$26
  Top 0.254: R12.2 68.26,89.32 R4.P$2
N$27  (via drill 0.6)
  Top 0.254: R13.1 C10.2 30.9,87.42 31.11,87.63 IC4.2 33.66,87.63 34.29,88.27 R7.2 R6.2 31.65,90.59 v31.11,91.12
  Bottom 0.254: 41.62,91.12 R3.P$3 40.97,91.11 40.01,92.08 38.42,92.08 37.78,91.44 31.43,91.44 v31.11,91.12
N$28
  Top 0.254: R24.1 C18.1
N$29
  Top 0.254: IC5.10 61.28,79.69 62.23,80.64 62.23,81.92 62.76,82.45 R24.2 63.5,83.19 63.82,83.5 65.41,83.5 66.04,84.14 R17.2 R18.2
N$30
  Top 0.254: IC12.6 36.2,21.27 36.41,21.06 R103.1 R106.2 R122.1
N$31  (via drill 0.6)
  Top 0.254: 29.53,89.11 C10.1 30.9,89.11 31.11,88.9 IC4.1 | 29.53,89.11 R13.2 28.22,89.08 26.85,89.08 v26.35,88.58 | IC5.14 57.78,84.77 57.15,85.41 v57.15,86.04 | 29.53,89.11 D3.C
  Bottom 0.254: v26.35,88.58 43.18,88.58 45.72,86.04 v57.15,86.04
N$32  (via drill 0.6)
  Top 0.254: v36.83,45.72 37.47,45.09 R82.1
  Bottom 0.254: v36.83,45.72 33.02,41.91 11.75,41.91 9.21,44.45 J7.P3
N$33
  Top 0.254: R77.2 39.16,43.5 39.69,43.5 40.01,43.81 40.01,44.45 40.64,45.09 43.81,45.09 44.13,44.77 R68.P$2
N$34  (via drill 0.6)
  Top 0.254: IC10.1 31.11,40.96 30.9,41.17 C38.1 R84.2 | v56.83,29.21 IC11.11 | v26.99,29.53 25.72,30.8 25.72,40.01 26.89,41.17 R84.2 | R84.2 D10.C
  Bottom 0.254: v56.83,29.21 56.52,28.89 27.62,28.89 v26.99,29.53
N$35  (via drill 0.6)
  Top 0.254: R78.2 R79.2 R80.2 34.29,42.23 33.97,41.91 33.97,40.01 33.66,39.69 IC10.2 31.11,39.69 30.9,39.47 C38.2 R84.1 28.36,39.69 v26.99,39.69 | 65.72,43.44 R69.P$3 65.76,42.19 v67.63,40.32
  Bottom 0.254: v26.99,39.69 50.16,39.69 51.12,40.64 67.31,40.64 v67.63,40.32
N$36  (via drill 0.6)
  Top 0.254: R78.1 31.01,44.45 31.11,44.55 31.11,45.09 v30.48,45.72
  Bottom 0.254: v30.48,45.72 28.57,43.81 21.91,43.81 J8.P3
N$37
  Top 0.254: R83.2 68.26,41.7 R69.P$2
N$38
  Top 0.254: IC10.13 36.2,39.69 35.88,40.01 R81.2 R82.2 37.57,42.55 39.69,42.55 | C39.2 R85.1 44.35,41.27 D11.A
  Top 0.305: 39.69,42.55 40.62,43.48 R68.P$3 41.59,43.44 41.59,41.59 41.91,41.27 D11.A
N$39
  Top 0.254: R97.1 62.87,29.43 C49.1
N$40
  Top 0.254: IC11.10 59.22,27.84 R99.2 61.38,27.94 R97.2
N$41
  Top 0.254: R73.1 55.66,45.82 55.24,45.4 IC9.2 52.39,45.4 52.17,45.19 R75.1 | R73.1 R71.1 | R72.2 54.08,48.26 R73.1
N$43
  Top 0.254: IC11.2 R89.2 R86.2
N$44
  Top 0.254: C40.1 52.17,40.54 52.39,40.32 IC9.6 55.24,40.32 55.56,40.01 55.56,32.07 55.24,31.75 IC11.4
N$45
  Top 0.254: C47.1 64.03,34.29 R90.1
N$47
  Top 0.254: R56.1 49.85,59.79 C29.1
N$48
  Top 0.254: R87.2 R90.2 IC11.15
N$49
  Top 0.254: C41.1 60.54,40.54 60.33,40.32 IC9.9 57.78,40.32 57.47,40.01 57.47,32.07 57.78,31.75 IC11.13
N$50  (via drill 0.6)
  Top 0.254: R71.2 58.1,49.85 v59.69,48.26 | 59.05,38.99 IC9.8 60.33,39.05 60.54,38.84 C41.2 62.02,38.84 62.23,39.05 62.23,40.01 62.55,40.32 64.45,40.32 | JP13.2 66.36,37.47 66.04,37.78 65.72,37.78 64.45,39.05 64.45,40.32 | 64.45,40.32 v64.45,46.99
  Bottom 0.254: v59.69,48.26 60.96,46.99 v64.45,46.99
N$51
  Top 0.254: R94.1 C48.1
N$52
  Top 0.254: IC11.7 52.7,27.94 52.49,28.16 R98.2 51.65,28.26 51.12,28.26 50.16,29.21 R94.2
N$53
  Top 0.254: R76.2 IC9.13 57.78,45.4 56.2,43.81 56.2,31.43 55.24,30.48 IC11.5
N$54
  Top 0.254: R76.1 R74.2
N$55
  Top 0.254: R73.2 58.1,48.26 59.12,47.25 IC9.14 60.33,46.67 60.64,46.99 R74.1 61.28,47.09 61.28,47.62 61.59,47.94 65.09,47.94 67.63,45.4 71.44,45.4 72.07,44.77 72.07,42.23 71.44,41.59 R88.1 71.33,36.2 70.8,36.2 70.48,35.88 70.48,33.66 69.85,33.02 69.85,30.16 64.45,24.77 61.91,24.77 61.28,25.4 R99.1
N$56
  Top 0.406: JP11.1 JP11.2 51.12,100.33 52.07,99.38 D2.A
N$57  (via drill 0.6)
  Top 0.254: IC11.6 52.7,29.21 51.75,30.16 v51.75,30.48 | R93.2 v41.27,30.48 | IC10.8 38.73,33.34 38.95,33.12 C46.1 R93.2 | D12.C 43.15,33.12 R93.2
  Bottom 0.254: v41.27,30.48 v51.75,30.48
N$58
  Top 0.254: R93.1 C46.2 38.95,34.82 38.73,34.61 IC10.9 36.2,34.61 35.88,34.29 R96.2 34.92,31.96 | R65.P$1 23.77,46.31 23.5,46.04 23.5,36.51 25.08,34.92 25.08,29.84 26.35,28.57 34.29,28.57 34.92,29.21 34.92,31.96 | 34.92,31.96 R95.2
N$59
  Top 0.254: R70.2 26.57,49.21 21.91,49.21 21.27,48.58 R65.P$2
N$60
  Top 0.254: Q1.C 53.98,4.62 53.98,6.67 54.93,7.62 LED1.K
N$61
  Top 0.254: IC7.7 31.11,57.15 30.9,56.94 R59.2 | IC7.7 32.38,57.09 | R62.1 33.76,54.29 33.02,54.29 32.33,54.99 IC7.7
N$62  (via drill 0.6)
  Top 0.254: J6.P3 7.62,57.15 10.79,53.98 10.79,51.44 12.7,49.53 12.7,33.66 v12.38,33.34 | v27.3,33.97 28.16,33.12 R91.1
  Bottom 0.254: v12.38,33.34 12.7,33.02 26.35,33.02 v27.3,33.97
N$63  (via drill 0.6)
  Top 0.254: J3.P3 11.75,84.14 11.75,75.25 v10.16,73.66 | v36.51,70.17 37.47,69.22 R48.1
  Bottom 0.254: v10.16,73.66 13.65,73.66 14.92,72.39 18.41,72.39 19.05,71.75 19.68,71.75 20.32,72.39 23.5,72.39 24.13,73.03 27.3,73.03 29.21,71.12 33.66,71.12 34.29,70.48 36.2,70.48 v36.51,70.17
N$64
  Top 0.406: JP11.10 JP11.9 60.96,105.09 P1.2
N$65
  Top 0.254: R43.2 39.16,67.31 39.69,67.31 40.01,67.63 40.01,68.26 40.64,68.9 43.81,68.9 44.13,68.58 R34.P$2
N$66  (via drill 0.6)
  Top 0.254: v57.15,54.61 IC8.11 | 29.53,64.98 R50.2 27.84,64.98 27.3,64.45 27.3,60.64 26.04,59.37 26.04,57.78 v29.21,54.61 | 29.53,64.98 C23.1 30.9,64.98 31.11,64.77 IC7.1 | 29.53,64.98 D7.C
  Bottom 0.254: v57.15,54.61 55.24,52.7 31.11,52.7 v29.21,54.61
N$67  (via drill 0.6)
  Top 0.254: R50.1 C23.2 30.9,63.28 31.11,63.5 IC7.2 33.97,63.5 34.29,63.82 v34.29,64.45 R46.2 R45.2 R44.2
  Bottom 0.254: R36.P$3 65.72,67.25 65.72,66.36 65.09,65.72 37.47,65.72 36.2,64.45 v34.29,64.45
N$68  (via drill 0.6)
  Top 0.254: J4.P3 19.37,86.36 19.37,78.11 20.32,77.15 20.32,73.98 20.95,73.34 v20.95,70.8 | v32.07,69.53 32.7,68.9 R45.1
  Bottom 0.254: v20.95,70.8 21.27,71.12 24.13,71.12 24.77,71.75 26.67,71.75 28.89,69.53 v32.07,69.53
N$69
  Top 0.254: R49.2 68.26,65.51 R36.P$2
N$70
  Top 0.254: IC7.13 36.2,63.5 35.88,63.82 R47.2 R48.2 39.79,66.46 40.62,67.3 R34.P$3 | R34.P$3 41.62,67.31 | C24.2 R51.1 42.83,64.98 D8.A 41.91,65.09 41.63,65.36 R34.P$3
N$71
  Top 0.254: R64.1 62.87,54.83 C34.1
N$72
  Top 0.254: IC8.10 60.33,53.34 60.64,53.02 R67.2 R64.2
N$73
  Top 0.254: R38.1 55.56,72.61 55.56,70.17 55.24,69.85 IC6.2 52.39,69.85 52.17,69.64 R40.1 | R38.1 R35.1 | R37.2 54.19,72.71 R38.1
N$75
  Top 0.254: IC8.2 R56.2 R52.2
N$76
  Top 0.254: C25.1 52.17,64.98 52.39,64.77 IC6.6 55.24,64.77 55.56,64.45 55.56,57.47 55.24,57.15 IC8.4
N$77
  Top 0.254: C30.1 64.03,59.69 R57.1
N$79
  Top 0.254: IC8.15 R57.2 R53.2
N$80
  Top 0.254: C26.1 60.54,64.98 60.33,64.77 IC6.9 57.78,64.77 57.47,64.45 57.47,57.47 57.78,57.15 IC8.13
N$81  (via drill 0.6)
  Top 0.254: IC6.8 60.33,63.5 60.54,63.28 C26.2 62.23,64.24 62.23,64.77 63.18,65.72 64.45,65.72 | v59.69,72.71 58.1,74.3 R35.2 | JP5.2 67.63,61.59 67.63,64.45 67.31,64.77 67.31,65.41 66.99,65.72 64.45,65.72 | 64.45,65.72 v64.45,71.44
  Bottom 0.254: v64.45,71.44 60.96,71.44 v59.69,72.71
N$82
  Top 0.254: R61.1 C33.1
N$83
  Top 0.254: IC8.7 R66.2 51.33,54.08 50.16,55.24 R61.2
N$84
  Top 0.254: R41.2 IC6.13 57.47,69.85 56.2,68.58 56.2,56.52 55.56,55.88 IC8.5
N$85
  Top 0.254: R41.1 R39.2
N$86
  Top 0.254: R38.2 58.1,72.71 59.12,71.69 IC6.14 60.33,71.12 60.64,71.44 R39.1 61.38,72.17 61.59,72.39 69.53,72.39 72.07,69.85 72.07,65.09 71.44,64.45 R55.1 | R67.1 67.63,53.02 70.17,55.56 70.17,58.1 70.48,58.42 70.48,60.96 70.7,61.17 R55.1 | R55.1 71.44,60.96
N$87  (via drill 0.6)
  Top 0.254: IC7.8 38.73,57.15 39.05,56.83 39.59,56.83 C32.1 R60.2 43.15,56.94 D9.C v43.18,55.24 | IC8.6 52.39,54.61 v51.75,55.24
  Bottom 0.254: v43.18,55.24 v51.75,55.24
N$88
  Top 0.254: R60.1 C32.2 38.95,58.63 38.73,58.42 IC7.9 36.2,58.42 35.88,58.1 R63.2 34.92,55.78 | 34.92,55.78 R62.2 | 34.92,55.78 34.92,53.34 34.29,52.7 29.21,52.7 27.94,53.98 27.94,54.93 25.4,57.47 25.4,59.37 23.77,61 R42.P$1
N$89
  Top 0.254: R58.2 R59.1 30.9,58.63 31.11,58.42 IC7.6
N$90
  Top 0.254: R54.2 21.27,60.74 R42.P$2
N$91
  Top 0.254: IC10.6 31.11,34.61 30.9,34.82 R92.1 R91.2
N$92  (via drill 0.6)
  Top 0.254: R58.1 28.47,56.83 27.94,56.83 26.99,57.78 v26.99,58.42 | v10.48,58.1 10.79,58.42 10.79,70.8 J5.P3
  Bottom 0.254: v26.99,58.42 26.67,58.1 v10.48,58.1
N$93
  Top 0.254: R111.2 66.67,12.38 66.99,12.7 J14.P3
N$94
  Top 0.254: R115.1 C57.1
N$96
  Top 0.254: 30.8,6.67 IC14.3 27.94,6.67 27.73,6.88 R117.2 | 30.8,6.67 IC14.6 35.56,6.67 36.41,5.82 R115.2 | R118.1 30.16,3.81 30.8,4.45 30.8,6.67
N$97
  Top 0.254: 29.21,2.01 R121.1 29.53,2.12 | 29.53,2.12 29.53,1.59 29.21,1.27 25.72,1.27 24.45,2.54 24.45,7.3 25.08,7.94 IC14.2 | 29.53,2.12 29.63,2.22 31.11,2.22 31.85,2.96 R119.2
N$98
  Top 0.254: C55.1 R113.2 R114.1
N$99
  Top 0.254: R120.2 34.29,3.81 | 34.29,3.81 R119.1 | IC14.5 34.29,5.34 34.29,3.81
N$100
  Top 0.254: IC14.1 27.94,9.21 27.44,9.71 D13.A
N$101
  Top 0.254: IC14.7 33.02,7.94 32.2,8.75 D14.A
N$102
  Top 0.254: D13.C 30.48,10.93 30.48,11.43 31.11,12.06 35.24,12.06 | 35.24,12.06 38.73,12.06 39.69,11.11 47.94,11.11 50.48,8.57 R113.1 | D14.C 35.24,10.93 35.24,12.06
N$103
  Top 0.254: R112.1 58.42,9.53 57.47,8.57 LED1.A
N$104
  Top 0.254: R116.2 51.01,7.2 R114.2 51.12,6.88 51.12,6.35 51.6,5.86 Q1.B
OUTPUT  (via drill 0.6)
  Top 0.254: IC13.1 52.7,19.05 52.49,19.27 R107.2 51.02,19.27 50.8,19.05 v50.8,13.34 51.75,12.38 R111.1 | C57.2 38.52,5.71 39.37,5.71 39.69,6.03 39.69,9.21 40.64,10.16 v47.62,10.16
  Bottom 0.254: v47.62,10.16 v50.8,13.34
PLUS_BUS  (via drill 0.6)
  Top 0.254: v61.28,84.14 61.28,83.19 60.33,82.23 IC5.12 57.78,82.23 57.47,81.92 57.47,78.42 56.2,77.15 53.02,77.15 52.39,76.52 R33.2 | v71.75,83.19 71.75,81.6 70.48,80.33 70.48,73.34 73.34,70.48 73.34,57.78 v73.03,57.47 72.71,57.15 72.71,53.98 70.48,51.75 70.48,49.53 73.34,46.67 73.34,32.7 v73.03,32.38 72.39,31.75 72.39,29.53 70.48,27.62 70.48,25.72 73.34,22.86 73.34,17.78 72.07,16.51 62.23,16.51 62.07,16.35 60.48,16.35 | IC13.6 60.33,16.51 60.48,16.35 | 60.48,16.35 60.54,16.3 R110.1 | R55.2 71.44,58.42 71.12,58.1 v71.12,57.47 | v70.8,32.38 70.8,33.02 71.44,33.66 R88.2
  Bottom 0.254: v71.75,83.19 62.23,83.19 v61.28,84.14 | v73.03,57.47 v71.12,57.47 | v73.03,32.38 v70.8,32.38
VCC  (via drill 0.6)
  Top 0.254: v58.42,90.17 58.2,89.95 C9.1 58.42,88.69 58.42,88.27 59.12,87.57 IC5.16 | 59.37,20.85 C52.1 | C58.+ 60.33,8.26 60.86,8.79 R112.2 | IC8.16 59.05,61.02 59.05,61.59 v59.69,62.23 | v64.14,61.59 C31.1
  Top 0.305: v60.33,96.52 60.96,95.89 60.96,95.35 C5.1 IC3.8 | IC6.4 52.7,67.31 51.85,68.16 C21.1 | v49.85,68.26 51.02,68.26 51.12,68.16 C21.1 | C21.1 51.44,68.26 | v49.85,43.81 51.33,43.81 C36.1 51.85,43.71 52.7,42.86 IC9.4 | C42.1 60.33,37.47 v60.01,37.78 59.12,36.89 IC11.16 | v28.26,86.04 29.43,86.04 C12.1 30.27,85.94 31.11,85.09 IC4.4 | IC7.4 31.11,60.96 30.27,61.81 C27.1 29.43,61.91 v28.26,61.91 | v59.37,21.91 59.37,20.85 | IC13.8 59.16,19.09 C52.1 | 31.11,37.15 IC10.4 | C43.1 29.43,38.1 v28.26,38.1 | IC12.8 35.14,23.97 C50.1 35.88,25.4 v37.15,24.13 | IC14.8 35.56,9.21 35.88,8.89 36.73,8.89 C56.1 38,8.99 v38.1,8.89
  Top 0.406: v27.62,101.28 25.72,101.28 24.77,102.23 19.37,102.23 5.08,87.95 v5.08,86.04 v5.08,60.96 v5.08,35.56 v5.08,25.4 v5.08,10.48 | v27.62,101.28 48.58,101.28 52.07,97.79 56.83,97.79 57.15,98.11 57.15,99.06 D2.C 59.05,99.38 60.33,100.65 67.63,100.65 v72.39,95.89 v75.56,92.71 v75.56,70.48 v75.56,61.59 v75.56,45.4 v75.56,37.78 v75.56,21.59 75.56,16.83 69.22,10.48 67.31,10.48 66.36,9.53 R112.2 | 31.11,37.15 30.27,38 C43.1 | v27.62,101.28 R1.1 | 27.62,104.31 C1.+ v24.45,104.46
  Bottom 0.254: v58.42,90.17 60.96,92.71 v75.56,92.71 | v59.69,62.23 60.33,61.59 v64.14,61.59 v75.56,61.59 | v75.56,37.78 65.72,37.78 65.09,38.42 60.64,38.42 v60.01,37.78
  Bottom 0.305: v72.39,95.89 72.07,96.2 60.64,96.2 v60.33,96.52 | v49.85,68.26 51.75,70.17 75.25,70.17 v75.56,70.48 | v49.85,43.81 51.44,45.4 v75.56,45.4 | v5.08,86.04 v28.26,86.04 | v28.26,61.91 25.08,65.09 17.78,65.09 13.65,60.96 v5.08,60.96 | v59.37,21.91 59.69,21.59 v75.56,21.59 | v28.26,38.1 25.72,35.56 v5.08,35.56 | v5.08,25.4 22.86,25.4 23.18,25.08 36.2,25.08 v37.15,24.13 | v5.08,10.48 35.24,10.48 36.83,8.89 v38.1,8.89
  Bottom 0.406: v27.62,101.28 v24.45,104.46
VEE  (via drill 0.6)
  Top 0.254: C51.2 59.05,24.98 | v37.78,100.01 36.83,100.01 36.51,99.69 R2.1 | v28.57,16.83 28.89,16.83 29.63,17.57 C53.2
  Top 0.305: 53.66,91.38 IC3.4 53.6,90.64 | IC5.9 61.17,78.42 C20.2 61.38,78.42 v63.18,78.42 | IC6.11 60.33,67.31 61.17,68.16 C22.2 62.02,68.26 v63.18,68.26 | IC8.9 59.12,50.84 C35.2 59.05,50.7 58.95,50.8 58.42,50.8 v57.15,52.07 | IC9.11 60.33,42.86 61.17,43.71 C37.2 62.02,43.81 v63.18,43.81 | IC4.11 38.73,85.09 39.59,85.94 C13.2 40.42,86.04 v41.59,86.04 | 29.53,18.31 C53.2 29.79,18.57 IC12.4 | v3.17,19.05 v3.17,32.38 | v55.88,13.97 C54.2 53.91,14.24 IC13.4 | IC11.9 59.12,25.25 C51.2 60.01,25.08 v60.33,24.77 | 53.6,90.64 C8.2 | 53.6,90.64 54.07,90.17 v54.61,90.17 | 39.69,37.15 IC10.11 | v39.69,37.78 39.69,37.15 | C44.2 39.69,36.3 39.69,37.15 | 40.01,60.22 C28.2 39.79,60.96 | v39.69,61.59 39.79,61.59 39.79,60.96 | 39.79,60.96 IC7.11
  Top 0.406: v76.83,15.24 v76.83,23.81 v76.83,41.91 v76.83,53.02 v76.83,68.9 v76.83,78.42 v76.83,94.3 76.83,97.47 70.17,104.14 D1.A P1.1 67.94,105.22 67.94,106.05 67.31,106.68 49.53,106.68 45.4,102.55 38.73,102.55 | v3.17,32.38 v3.17,62.23 v3.17,87.95 18.41,103.19 25.08,103.19 25.72,102.55 v37.78,102.55 38.73,102.55 | C2.- 38.73,104.31 38.73,102.55
  Bottom 0.254: v37.78,102.55 v37.78,100.01
  Bottom 0.305: v76.83,78.42 v63.18,78.42 | v63.18,68.26 63.82,68.9 v76.83,68.9 | v57.15,52.07 58.1,53.02 v76.83,53.02 | v63.18,43.81 63.18,42.86 64.14,41.91 v76.83,41.91 | v41.59,86.04 32.38,86.04 31.43,87 27.3,87 26.99,86.68 6.35,86.68 5.08,87.95 v3.17,87.95 | v39.69,61.59 30.8,61.59 26.67,65.72 17.46,65.72 13.34,61.59 6.03,61.59 5.4,62.23 v3.17,62.23 | v76.83,23.81 61.28,23.81 v60.33,24.77 | v3.17,32.38 v27.3,32.38 32.7,37.78 v39.69,37.78 | v28.57,16.83 26.35,19.05 v3.17,19.05 | v55.88,13.97 57.15,15.24 v76.83,15.24 | v54.61,90.17 58.74,94.3 v76.83,94.3

## Text on the board
bPlace: stripe | Red | 0dB | -6dB | Pre-gain
tNames: Shelves | cc-by-sa Émilie Gillet, 2014. v0.5
bNames: +12V | GND | -12V | Shelves | cc-by-sa Émilie Gillet, 2014. v0.5 | GND | GND